# Altium schematic sheet NCKH 2020_Dam.SchDoc
size A3
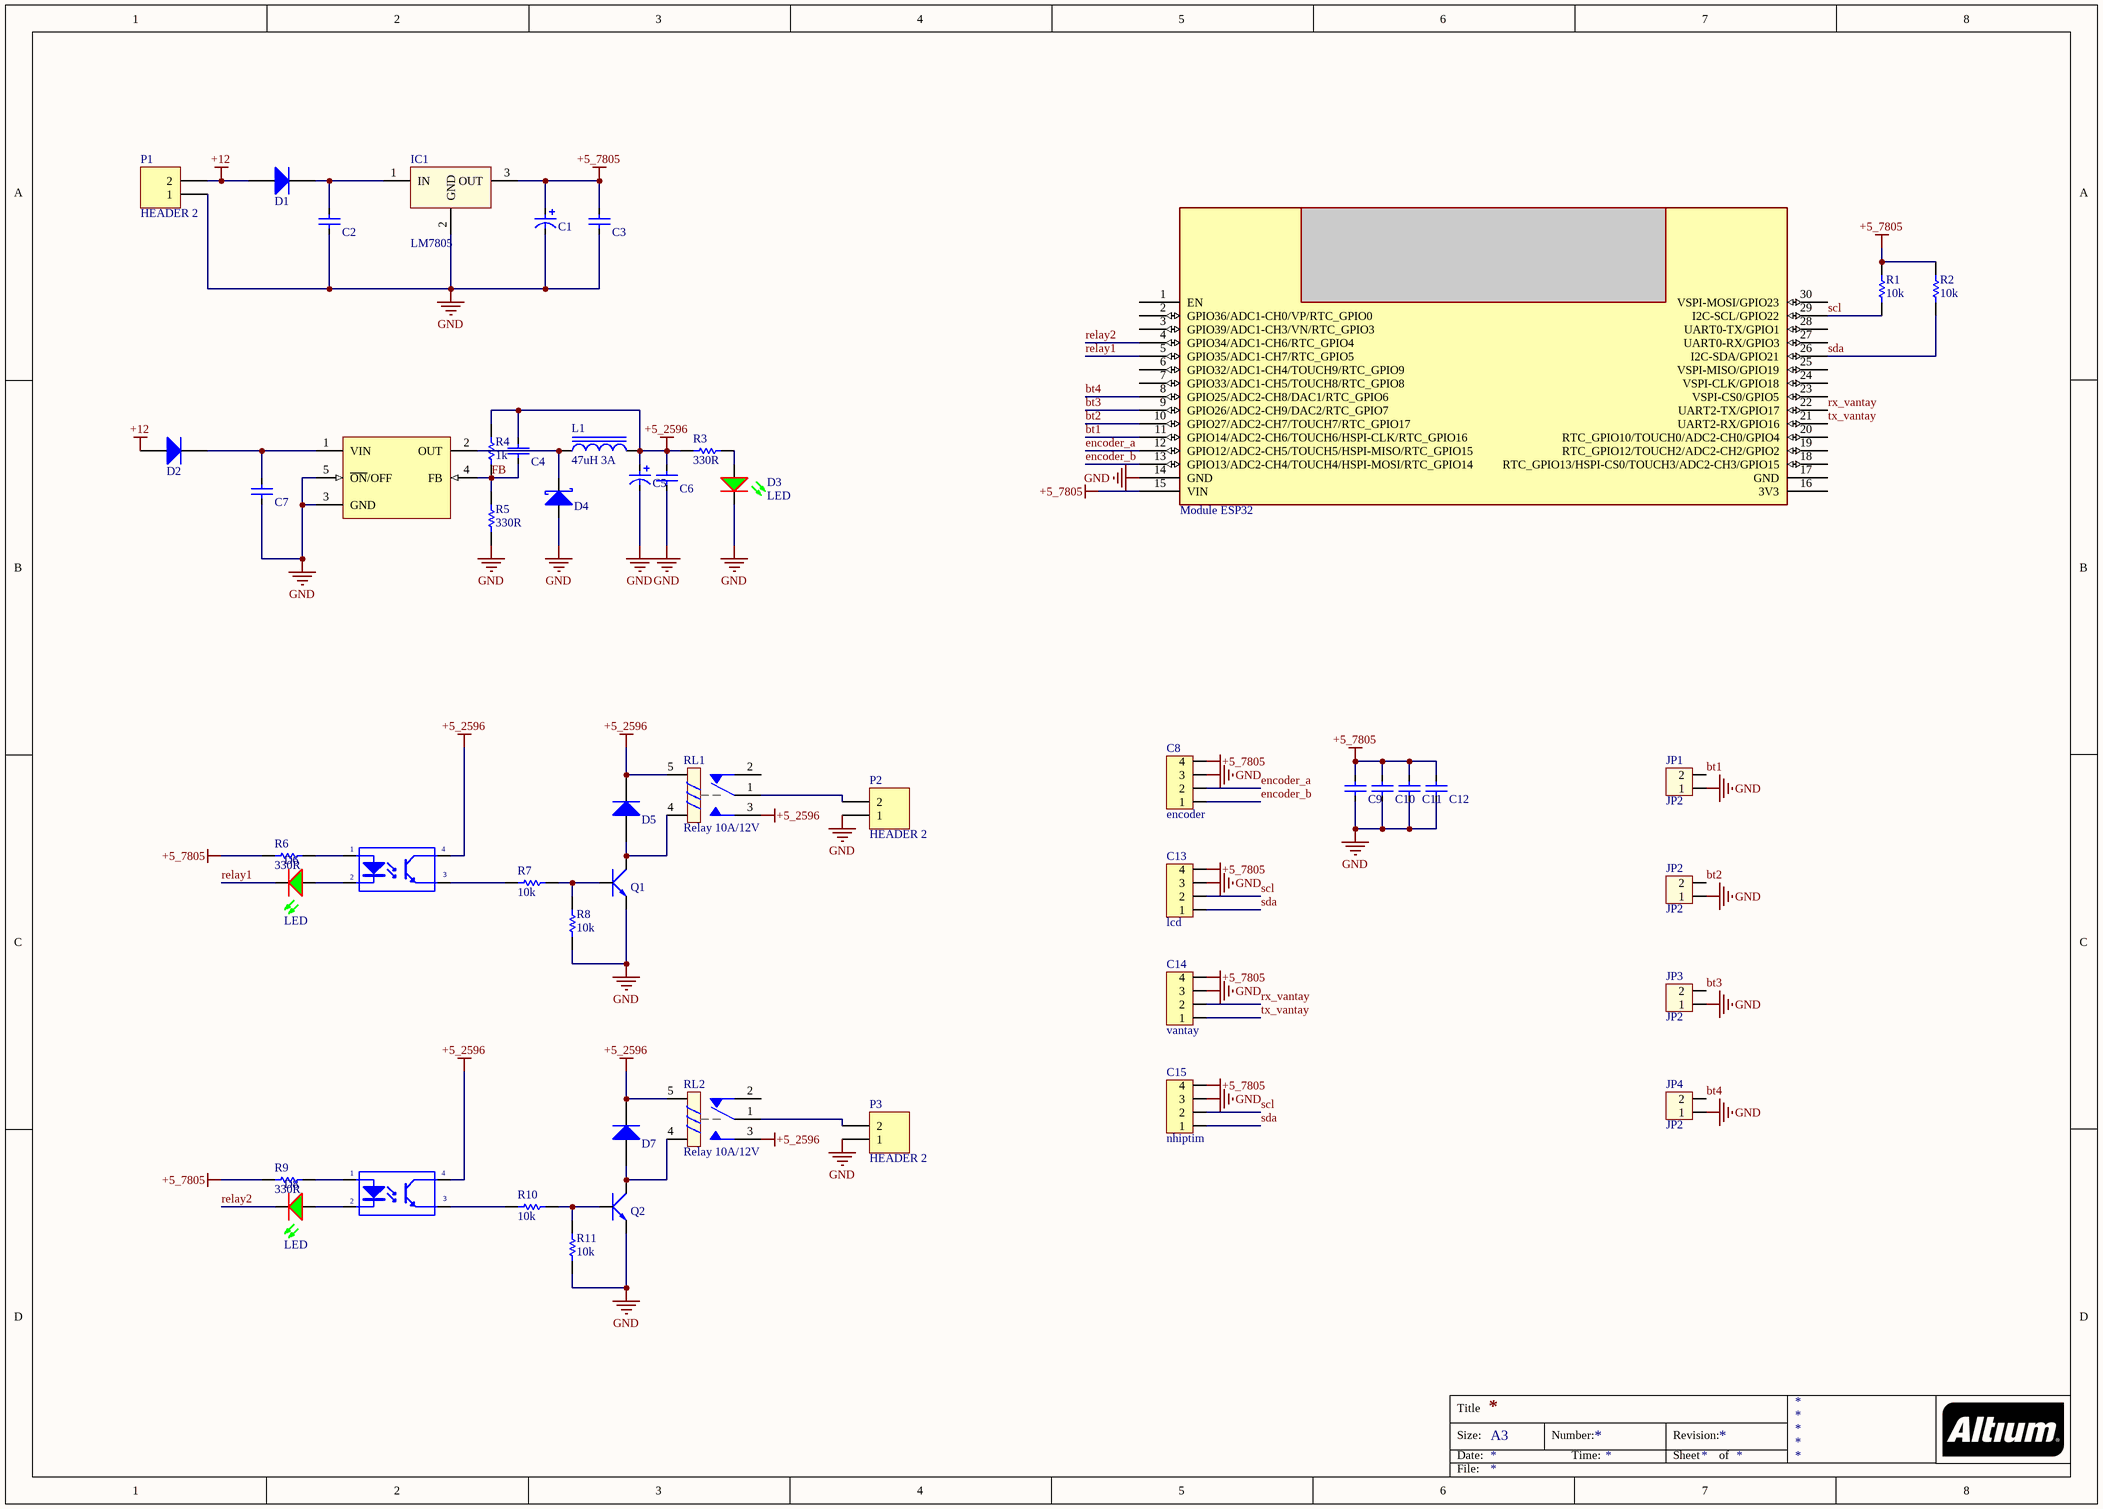
[diagram p0: NCKH 2020_Dam.SchDoc]

## Parts
1  LM2596  [TO263]  (value not drawn)
*1  Module ESP32  [Module ESP32]
C1  10uF case A 3216  [CAP TANTALUM A CASE]  (value not drawn)
C2  104  [CAP-0805-SC]  (value not drawn)
C3  104  [CAP-0805-SC]  (value not drawn)
C4  104  [CAP-0805-SC]  (value not drawn)
C5  10uF case A 3216  [CAP TANTALUM A CASE]  (value not drawn)
C6  104  [CAP-0805-SC]  (value not drawn)
C7  104  [CAP-0805-SC]  (value not drawn)
C8  encoder  [Header4]
C9  104  [CAP-0805-SC]  (value not drawn)
C10  104  [CAP-0805-SC]  (value not drawn)
C11  104  [CAP-0805-SC]  (value not drawn)
C12  104  [CAP-0805-SC]  (value not drawn)
C13  lcd  [Header4]
C14  vantay  [Header4]
C15  nhiptim  [Header4]
D1  M4  [DO 214AC]  (value not drawn)
D2  M4  [DO 214AC]  (value not drawn)
D3  LED  [LED_SMD_0805]
D4  SS34  [DO 214AC]  (value not drawn)
D5  M4  [DO 214AC]  (value not drawn)
D6  LED  [LED_SMD_0805]
D7  M4  [DO 214AC]  (value not drawn)
D8  LED  [LED_SMD_0805]
IC1  LM7805  [QTO-220H3]
JP1  JP2  [CON2]
JP2  JP2  [CON2]
JP3  JP2  [CON2]
JP4  JP2  [CON2]
L1  47uH 3A  [INDUCTOR SMD 3A]
P1  HEADER 2  [KF7.62]
P2  HEADER 2  [KF7.62]
P3  HEADER 2  [KF7.62]
Q1  C1815  [SOT23]  (value not drawn)
Q2  C1815  [SOT23]  (value not drawn)
R1  10k  [RES-0805-SC]
R2  10k  [RES-0805-SC]
R3  330R  [RES-0805-SC]
R4  1k  [RES-0805-SC]
R5  330R  [RES-0805-SC]
R6  330R  [RES-0805-SC]
R7  10k  [RES-0805-SC]
R8  10k  [RES-0805-SC]
R9  330R  [RES-0805-SC]
R10  10k  [RES-0805-SC]
R11  10k  [RES-0805-SC]
RL1  Relay 10A/12V  [RL_SPDT_10A]
RL2  Relay 10A/12V  [RL_SPDT_10A]
U1  PC817  [PC817]  (value not drawn)
U2  PC817  [PC817]  (value not drawn)

## Nets
+5_2596: C4.1 C5.1 C6.1 D5.2(K) D7.2(K) L1.2 R3.2 R4.2 RL1.3 RL1.5 RL2.3 RL2.5 U1.4(C) U2.4(C)
+5_7805: *1.15(VIN) C1.1 C3.1 C8.4 C9.1 C10.1 C11.1 C12.1 C13.4 C14.4 C15.4 IC1.3(OUT) R1.2 R2.2 R6.2 R9.2
+12: D1.1(A) D2.1(A) P1.2
GND: 1.3(GND) 1.5(~{ON}/OFF) *1.14(GND) C1.2 C2.2 C3.2 C5.2 C6.2 C7.2 C8.3 C9.2 C10.2 C11.2 C12.2 C13.3 C14.3 C15.3 D3.2(K) D4.1(A) IC1.2(GND) JP1.1 JP2.1 JP3.1 JP4.1 P1.1 P2.1 P3.1 Q1.2(E) Q2.2(E) R5.1 R8.1 R11.1
bt1: *1.11(GPIO14/ADC2-CH6/TOUCH6/HSPI-CLK/RTC_GPIO16) JP1.2
bt2: *1.10(GPIO27/ADC2-CH7/TOUCH7/RTC_GPIO17) JP2.2
bt3: *1.9(GPIO26/ADC2-CH9/DAC2/RTC_GPIO7) JP3.2
bt4: *1.8(GPIO25/ADC2-CH8/DAC1/RTC_GPIO6) JP4.2
encoder_a: *1.12(GPIO12/ADC2-CH5/TOUCH5/HSPI-MISO/RTC_GPIO15) C8.2
encoder_b: *1.13(GPIO13/ADC2-CH4/TOUCH4/HSPI-MOSI/RTC_GPIO14) C8.1
FB: 1.4(FB) C4.2 R4.1 R5.2
relay1: *1.5(GPIO35/ADC1-CH7/RTC_GPIO5) D6.2(K)
relay2: *1.4(GPIO34/ADC1-CH6/RTC_GPIO4) D8.2(K)
rx_vantay: *1.22(UART2-TX/GPIO17) C14.2
scl: *1.29(I2C-SCL/GPIO22) C13.2 C15.2 R1.1
sda: *1.26(I2C-SDA/GPIO21) C13.1 C15.1 R2.1
tx_vantay: *1.21(UART2-RX/GPIO16) C14.1
Net1_1: 1.1(VIN) C7.1 D2.2(K)
Net1_2: 1.2(OUT) D4.2(K) L1.1
NetC2_1: C2.1 D1.2(K) IC1.1(IN)
NetD3_1: D3.1(A) R3.1
NetD5_1: D5.1(A) Q1.3(C) RL1.4
NetD6_1: D6.1(A) U1.2(K)
NetD7_1: D7.1(A) Q2.3(C) RL2.4
NetD8_1: D8.1(A) U2.2(K)
NetP2_2: P2.2 RL1.1
NetP3_2: P3.2 RL2.1
NetQ1_1: Q1.1(B) R7.1 R8.2
NetQ2_1: Q2.1(B) R10.1 R11.2
NetR6_1: R6.1 U1.1(A)
NetR7_2: R7.2 U1.3(E)
NetR9_1: R9.1 U2.1(A)
NetR10_2: R10.2 U2.3(E)

Not connected (* = marked no-connect by the designer): *1 1(EN) 2(GPIO36/ADC1-CH0/VP/RTC_GPIO0) 3(GPIO39/ADC1-CH3/VN/RTC_GPIO3) 6(GPIO32/ADC1-CH4/TOUCH9/RTC_GPIO9) 7(GPIO33/ADC1-CH5/TOUCH8/RTC_GPIO8) 16(3V3) 17(GND) 18(RTC_GPIO13/HSPI-CS0/TOUCH3/ADC2-CH3/GPIO15) 19(RTC_GPIO12/TOUCH2/ADC2-CH2/GPIO2) 20(RTC_GPIO10/TOUCH0/ADC2-CH0/GPIO4) 23(VSPI-CS0/GPIO5) 24(VSPI-CLK/GPIO18) 25(VSPI-MISO/GPIO19) 27(UART0-RX/GPIO3) 28(UART0-TX/GPIO1) 30(VSPI-MOSI/GPIO23); RL1 2; RL2 2

## Notes on the sheet
- Title
- Size:
- Date:
- A3
- Number:
- Time:
- Revision:
- Sheet
- of
- File:

## Library data of the parts
C1 C5 = CAP TANTALUM
C2-C4 C6 C7 C9-C12 = CAP-SMDCHIP
C8 C13-C15 = Header4: Header IDC, 4 x 1 Pin Vertical 2.54mm Pitch (Non-Boxed, Male); Manufacturer: W¨¹rth Elektronik eiSos GmbH; partNo: 613002143121; ComponentLink1 Description: Manufacturer; ComponentLink2 Description: Datasheet; NoPins: 02; Created Date: 29 March 2013; ComponentLink1URL: http://www.we-online.com; ComponentLink2URL: http://katalog.we-online.de/em/datasheet/6130xx143121.pdf; Created by: Karrer Zheng
D1 D2 D5 D7 = DIODE
D4 = DIODE SCHOTTKY: Value: 1A-Schottkey
IC1 = LM78xx: On ap +, from + 5 to + 24VDC; Value: LM7805
JP1-JP4 = Con2: Connector 2; Value: Connector 2
L1 = INDUCTOR
R1-R11 = RES
RL1 RL2 = Relay 1: Relay SPDT,10A - 12VDC 5 Pin; Value: Relay SPDT, 10A, 12V